# EAGLE design CMP3_Amp (EAGLE 9.2.1)
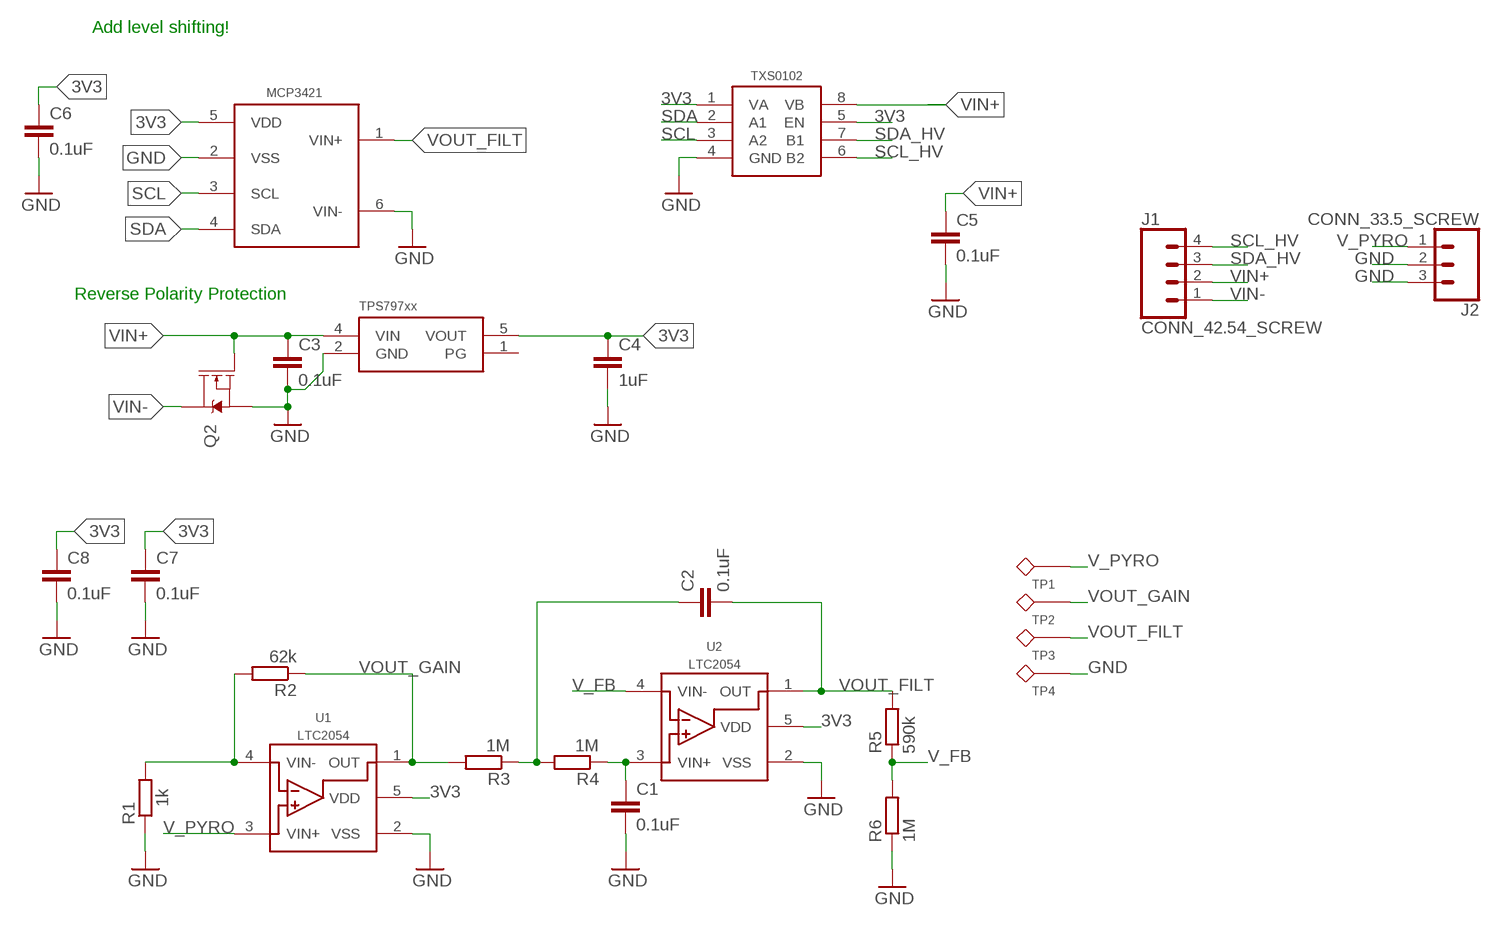
[diagram p0: schematic, sheet 1]

## Parts
C1  0.1uF  C-EU0.1UFC0603  [C0603]
C2  0.1uF  C-EU0.1UFC0603  [C0603]
C3  0.1uF  C-EU0.1UFC0603  [C0603]
C4  1uF  C-EU1UFC0603  [C0603]
C5  0.1uF  C-EU0.1UFC0402  [C0402]
C6  0.1uF  C-EU0.1UFC0402  [C0402]
C7  0.1uF  C-EU0.1UFC0402  [C0402]
C8  0.1uF  C-EU0.1UFC0402  [C0402]
J1  CONN_42.54_SCREW  [1X04_SCREW]
J2  CONN_33.5_SCREW  [1X03_3.5MM_SCREW]
Q2  DMG3404  MOSFET-NCH-DMG3404L  [SOT23-3]
R1  1k  R-EU_P1KR0603  [R0603]
R2  62k  R-EU_P62KR0603  [R0603]
R3  1M  R-EU_1MR0603  [R0603]
R4  1M  R-EU_1MR0603  [R0603]
R5  590k  R-EU_590KR0603  [R0603]
R6  1M  R-EU_1MR0603  [R0603]
TP1  TESTPOINTRCU  [TESTPOINT_0603]
TP2  TESTPOINTRCU  [TESTPOINT_0603]
TP3  TESTPOINTRCU  [TESTPOINT_0603]
TP4  TESTPOINTRCU  [TESTPOINT_0603]
U1  LTC2054  [SOT23-5]
U2  LTC2054  [SOT23-5]
U3  MCP3421A1  [SOT23-6L]
U4  TXS0102DQM  [DQM_R-PX2SON-N8]
U5  TPS79733  [DCK_R-PDSO-G5]

## Nets
3V3: C4.1 C6.1 C7.1 C8.1 U1.5(VDD) U2.5(VDD) U3.5(VDD) U4.1(VA) U4.5(EN) U5.5(VOUT)
GND: C1.2 C3.2 C4.2 C5.2 C6.2 C7.2 C8.2 J2.2 J2.3 Q2.2(S) R1.1 R6.1 TP4.1 U1.2(VSS) U2.2(VSS) U3.2(VSS) U3.6(VIN-) U4.4(GND) U5.2(GND)
N$2: R1.2 R2.2 U1.4(VIN-)
N$5: C2.1 R3.1 R4.2
N$6: C1.1 R4.1 U2.3(VIN+)
SCL: U3.3(SCL) U4.3(A2)
SCL_HV: J1.4 U4.6(B2)
SDA: U3.4(SDA) U4.2(A1)
SDA_HV: J1.3 U4.7(B1)
V_FB: R5.1 R6.2 U2.4(VIN-)
V_PYRO: J2.1 TP1.1 U1.3(VIN+)
VIN+: C3.1 C5.1 J1.2 Q2.1(G) U4.8(VB) U5.4(VIN)
VIN-: J1.1 Q2.3(D)
VOUT_FILT: C2.2 R5.2 TP3.1 U2.1(OUT) U3.1(VIN+)
VOUT_GAIN: R2.1 R3.2 TP2.1 U1.1(OUT)
Unconnected: U5.1(PG)

## Notes on the sheet
- Add level shifting!
- Reverse Polarity Protection

## Library data of the parts
C1-C3 = bschulz_passives:C-EU: CAPACITOR, European symbol; DIGIKEY: 490-6051-1-ND; MF: Murata; MPN: GCM188R71E104KA57D
C4 = bschulz_passives:C-EU: CAPACITOR, European symbol; DIGIKEY: 490-10479-1-ND; MF: Murata; MPN: GRM188R61C105KA12D
C5-C8 = bschulz_passives:C-EU: CAPACITOR, European symbol; DIGIKEY: 490-4759-1-ND; MF: Murata; MPN: GCM155R71C104KA55D
J1 = bschulz:CONN_4: Genaric 4 pin connector; DIGIKEY: ED10563-ND; MF: On Shore; MPN: OSTVN04A150
J2 = bschulz:CONN_3: Genaric 3 pin connector; DIGIKEY: ED2636-ND; MF: OnShore; MPN: OSTTE030161
Q2 = bschulz:MOSFET-NCH: N-channel MOSFETs Voltage controlled devices that allow control of high current outputs. SparkFun Products: SparkFun OpenScale <https://www.sparkfun.com/products/13261> SparkFun Digital Sandbox <https://www.sparkfun.com/products/12651> SparkFun Monster Moto Shield <https://www.sparkfun.com/products/10182> SparkFun MOSFET Power Controller <https://www.sparkfun.com/products/11214>; DIGIKEY: DMG3404L-7DICT-ND; MF: Diodes Incorporated; MPN: DMG3404L-7
R1 = bschulz_passives:R-EU_: RESISTOR, European symbol Digikey Parts: Yageo, 0402 <https://www.digikey.com/products/en/resistors/chip-resistor-surface-mount/52?k=&pkeyword=&sf=0&FV=ffec1104%2Cfffc000d%2C1c0002%2C440067%2C1f140000%2Cffe00034%2C400004&quantity=&ColumnSort=0&page=1&stock=1&pageSize=25> Yageo, 0603 <https://www.digikey.com/products/en/resistors/chip-resistor-surface-mount/52?k=&pkeyword=&s=4356&s=47360&sf=0&FV=fffc000d%2C1c0002%2C142c040c%2C1f140000%2Cffe00034&quantity=10&ColumnSort=1000011&page=1&stock=1&pageSize=25> Panasonic, 0603 <https://www.digikey.com/products/en/resistors/chip-resistor-surface-mount/52?k=&pkeyword=&pv252=68&sf=0&FV=ffec373d%2C1c0002%2C142c040c%2C1f140000%2Cffe00034%2C80002%2Cc0001&quantity=&ColumnSort=0&page=1&stock=1&pageSize=25> Panasonic, precision, 0603 <https://www.digikey.com/products/en/resistors/chip-resistor-surface-mount/52?FV=ffec4907%2Cfffc000a%2Cc0172%2C142c040c%2C1f140000%2Cffe00034%2C1c0002&quantity=100&ColumnSort=2085&page=1&stock=1&pageSize=25> Panasonic, 0805 <https://www.digikey.com/products/en/resistors/chip-resistor-surface-mount/52?k=&pkeyword=&pv3=1&sf=0&FV=ffec373d%2C1c0002%2C1f140000%2Cffe00034%2C142c040d&quantity=&ColumnSort=0&page=1&stock=1&pageSize=25> Rohm, current sense <https://www.digikey.com/products/en/resistors/chip-resistor-surface-mount/52?k=&pkeyword=&pv3=1&sf=0&FV=ffecb688%2C1f140000%2Cffe00034%2C1c0002&quantity=&ColumnSort=0&page=1&stock=1&pageSize=25> Vishay, pulse proof automotive <https://www.digikey.com/products/en/resistors/chip-resistor-surface-mount/52?k=&pkeyword=&pv7=2&sf=0&FV=ffec5d6b%2Cffe00034%2C1f140000&quantity=&ColumnSort=0&page=1&stock=1&pageSize=25>; DIGIKEY: P1.0KDBCT-ND; MF: Panasonic; MPN: ERA-3AEB102V; VALUE_PART: 1k
R2 = bschulz_passives:R-EU_: RESISTOR, European symbol Digikey Parts: Yageo, 0402 <https://www.digikey.com/products/en/resistors/chip-resistor-surface-mount/52?k=&pkeyword=&sf=0&FV=ffec1104%2Cfffc000d%2C1c0002%2C440067%2C1f140000%2Cffe00034%2C400004&quantity=&ColumnSort=0&page=1&stock=1&pageSize=25> Yageo, 0603 <https://www.digikey.com/products/en/resistors/chip-resistor-surface-mount/52?k=&pkeyword=&s=4356&s=47360&sf=0&FV=fffc000d%2C1c0002%2C142c040c%2C1f140000%2Cffe00034&quantity=10&ColumnSort=1000011&page=1&stock=1&pageSize=25> Panasonic, 0603 <https://www.digikey.com/products/en/resistors/chip-resistor-surface-mount/52?k=&pkeyword=&pv252=68&sf=0&FV=ffec373d%2C1c0002%2C142c040c%2C1f140000%2Cffe00034%2C80002%2Cc0001&quantity=&ColumnSort=0&page=1&stock=1&pageSize=25> Panasonic, precision, 0603 <https://www.digikey.com/products/en/resistors/chip-resistor-surface-mount/52?FV=ffec4907%2Cfffc000a%2Cc0172%2C142c040c%2C1f140000%2Cffe00034%2C1c0002&quantity=100&ColumnSort=2085&page=1&stock=1&pageSize=25> Panasonic, 0805 <https://www.digikey.com/products/en/resistors/chip-resistor-surface-mount/52?k=&pkeyword=&pv3=1&sf=0&FV=ffec373d%2C1c0002%2C1f140000%2Cffe00034%2C142c040d&quantity=&ColumnSort=0&page=1&stock=1&pageSize=25> Rohm, current sense <https://www.digikey.com/products/en/resistors/chip-resistor-surface-mount/52?k=&pkeyword=&pv3=1&sf=0&FV=ffecb688%2C1f140000%2Cffe00034%2C1c0002&quantity=&ColumnSort=0&page=1&stock=1&pageSize=25> Vishay, pulse proof automotive <https://www.digikey.com/products/en/resistors/chip-resistor-surface-mount/52?k=&pkeyword=&pv7=2&sf=0&FV=ffec5d6b%2Cffe00034%2C1f140000&quantity=&ColumnSort=0&page=1&stock=1&pageSize=25>; DIGIKEY: P62KDBCT-ND; MF: Panasonic; MPN: ERA-3AEB623V; VALUE_PART: 62k
R3 R4 R6 = bschulz_passives:R-EU_: RESISTOR, European symbol Digikey Parts: Yageo, 0402 <https://www.digikey.com/products/en/resistors/chip-resistor-surface-mount/52?k=&pkeyword=&sf=0&FV=ffec1104%2Cfffc000d%2C1c0002%2C440067%2C1f140000%2Cffe00034%2C400004&quantity=&ColumnSort=0&page=1&stock=1&pageSize=25> Yageo, 0603 <https://www.digikey.com/products/en/resistors/chip-resistor-surface-mount/52?k=&pkeyword=&s=4356&s=47360&sf=0&FV=fffc000d%2C1c0002%2C142c040c%2C1f140000%2Cffe00034&quantity=10&ColumnSort=1000011&page=1&stock=1&pageSize=25> Panasonic, 0603 <https://www.digikey.com/products/en/resistors/chip-resistor-surface-mount/52?k=&pkeyword=&pv252=68&sf=0&FV=ffec373d%2C1c0002%2C142c040c%2C1f140000%2Cffe00034%2C80002%2Cc0001&quantity=&ColumnSort=0&page=1&stock=1&pageSize=25> Panasonic, precision, 0603 <https://www.digikey.com/products/en/resistors/chip-resistor-surface-mount/52?FV=ffec4907%2Cfffc000a%2Cc0172%2C142c040c%2C1f140000%2Cffe00034%2C1c0002&quantity=100&ColumnSort=2085&page=1&stock=1&pageSize=25> Panasonic, 0805 <https://www.digikey.com/products/en/resistors/chip-resistor-surface-mount/52?k=&pkeyword=&pv3=1&sf=0&FV=ffec373d%2C1c0002%2C1f140000%2Cffe00034%2C142c040d&quantity=&ColumnSort=0&page=1&stock=1&pageSize=25> Rohm, current sense <https://www.digikey.com/products/en/resistors/chip-resistor-surface-mount/52?k=&pkeyword=&pv3=1&sf=0&FV=ffecb688%2C1f140000%2Cffe00034%2C1c0002&quantity=&ColumnSort=0&page=1&stock=1&pageSize=25> Vishay, pulse proof automotive <https://www.digikey.com/products/en/resistors/chip-resistor-surface-mount/52?k=&pkeyword=&pv7=2&sf=0&FV=ffec5d6b%2Cffe00034%2C1f140000&quantity=&ColumnSort=0&page=1&stock=1&pageSize=25>; DIGIKEY: P1.00MHCT-ND; MF: Panasonic; MPN: ERJ-3EKF1004V; VALUE_PART: 1M
R5 = bschulz_passives:R-EU_: RESISTOR, European symbol Digikey Parts: Yageo, 0402 <https://www.digikey.com/products/en/resistors/chip-resistor-surface-mount/52?k=&pkeyword=&sf=0&FV=ffec1104%2Cfffc000d%2C1c0002%2C440067%2C1f140000%2Cffe00034%2C400004&quantity=&ColumnSort=0&page=1&stock=1&pageSize=25> Yageo, 0603 <https://www.digikey.com/products/en/resistors/chip-resistor-surface-mount/52?k=&pkeyword=&s=4356&s=47360&sf=0&FV=fffc000d%2C1c0002%2C142c040c%2C1f140000%2Cffe00034&quantity=10&ColumnSort=1000011&page=1&stock=1&pageSize=25> Panasonic, 0603 <https://www.digikey.com/products/en/resistors/chip-resistor-surface-mount/52?k=&pkeyword=&pv252=68&sf=0&FV=ffec373d%2C1c0002%2C142c040c%2C1f140000%2Cffe00034%2C80002%2Cc0001&quantity=&ColumnSort=0&page=1&stock=1&pageSize=25> Panasonic, precision, 0603 <https://www.digikey.com/products/en/resistors/chip-resistor-surface-mount/52?FV=ffec4907%2Cfffc000a%2Cc0172%2C142c040c%2C1f140000%2Cffe00034%2C1c0002&quantity=100&ColumnSort=2085&page=1&stock=1&pageSize=25> Panasonic, 0805 <https://www.digikey.com/products/en/resistors/chip-resistor-surface-mount/52?k=&pkeyword=&pv3=1&sf=0&FV=ffec373d%2C1c0002%2C1f140000%2Cffe00034%2C142c040d&quantity=&ColumnSort=0&page=1&stock=1&pageSize=25> Rohm, current sense <https://www.digikey.com/products/en/resistors/chip-resistor-surface-mount/52?k=&pkeyword=&pv3=1&sf=0&FV=ffecb688%2C1f140000%2Cffe00034%2C1c0002&quantity=&ColumnSort=0&page=1&stock=1&pageSize=25> Vishay, pulse proof automotive <https://www.digikey.com/products/en/resistors/chip-resistor-surface-mount/52?k=&pkeyword=&pv7=2&sf=0&FV=ffec5d6b%2Cffe00034%2C1f140000&quantity=&ColumnSort=0&page=1&stock=1&pageSize=25>; DIGIKEY: 311-590KHRCT-ND; MF: Yageo; MPN: RC0603FR-07590KL; VALUE_PART: 590k
TP1-TP4 = bschulz:TESTPOINT; DIGIKEY: A106145CT-ND; MF: TE Connectivity; MPN: RCU-0C
U1 U2 = bschulz:LTC2054: LTC2054 -Single Micropower Zero Drift Op-Amp Characteristics: Vs: 2.7 ~ 6V (2.7 ~ +/- 5.5V for LTC2054HV) Iq: 175uA GBP: 500kHz PSSR: 130dB CMMR: 130dB Operating Temperature: -40°C to 85°C Digikey: LTC2054CS5#TRPBFCT-ND <https://www.digikey.com/scripts/DkSearch/dksus.dll?Detail&itemSeq=258611552&uq=636603257096973101> LTC2054HVIS5#TRMPBFCT-ND (High Voltage Variant) <https://www.digikey.com/product-detail/en/linear-technology-analog-devices/LTC2054HVIS5-TRMPBF/LTC2054HVIS5-TRMPBFCT-ND/3830416>; DIGIKEY: LTC2054HS5#TRMPBFCT-ND; DISP: LTC2054; MF: LT; MPN: LTC2054HS5#TRMPBF
U3 = bschulz:MCP342*: MCP342* - Sigma Delta ADC Characteristics: VCC: 2.7~5.5V Operating Temperature: -40°C to 125°C Number of Inputs: 1 (Differenital) Sample Rate: 15 Samples Per Second Number of Bits: 16 (MCP3425), 18 (MCP3421) Digikey: MCP3421 MCP3425A0T-E/CHCT-ND <https://www.digikey.com/product-detail/en/microchip-technology/MCP3425A0T-E-CH/MCP3425A0T-E-CHCT-ND/1979810> MCP3425 MCP3421A0T-E/CHCT-ND <https://www.digikey.com/product-detail/en/microchip-technology/MCP3421A0T-E-CH/MCP3421A0T-E-CHCT-ND/2183406> MCP3421A1T-E/CHCT-ND <https://www.digikey.com/product-detail/en/microchip-technology/MCP3421A1T-E-CH/MCP3421A1T-E-CHCT-ND/2183407> MCP3421A3T-E/CHCT-ND <https://www.digikey.com/product-detail/en/microchip-technology/MCP3421A3T-E-CH/MCP3421A3T-E-CHCT-ND/2183409>; DIGIKEY: MCP3421A1T-E/CHCT-ND; DISP: MCP3421; MF: Microchip; MPN: MCP3421A1T-E/CH
U4 = bschulz:TXS0102: TXS0102 - 2 Channel Bidirectional Voltage Level Translator Characteristics: Vcc: 1.65 ~ 3.6V (Port A), 2.3 ~ 5.5V (Port B) IQ: 14.4μA Output Current: 50mA Output Type: Open Drain/Push-Pull Operating Temperature: -40°C to 85°C Digikey: 296-28368-1-ND (DQE) <https://www.digikey.com/product-detail/en/texas-instruments/TXS0102DQER/296-28368-1-ND/2625893> 296-28435-1-ND (DQM) <https://www.digikey.com/product-detail/en/texas-instruments/TXS0102DQMR/296-28435-1-ND/2638910> 296-21931-1-ND (DCU) <https://www.digikey.com/product-detail/en/texas-instruments/TXS0102DCUR/296-21931-1-ND/1629284>; DIGIKEY: 296-28435-1-ND; MF: TI; MPN: TXS0102DQMR
U5 = bschulz:TPS797*: TPS797* - Ultra Low Power Low Dropout Linear Regulator Characteristics: Vin: 1.4V ~ 5.5V Vout: 1.8, 2.85, 3.0, 3.3V fixed IQ: 1.2μA typ, 2μA max Voltage Accuracy: 4% max Dropout Voltage: 105mV @ 10mA Output Current: 50 mA Operating Temperature: -40°C to 85°C Digikey: TPS79733 (3.3V Fixed) <https://www.digikey.com/product-detail/en/texas-instruments/TPS79733DCKR/296-11990-1-ND/390520> TPS79730 (3.0V Fixed) <https://www.digikey.com/product-detail/en/texas-instruments/TPS79730DCKR/296-11989-1-ND/390518> TPS797285 (2.85V Fixed) <https://www.digikey.com/product-detail/en/texas-instruments/TPS797285DCKR/296-25465-1-ND/2187585> TPS79718 (1.8V Fixed) <https://www.digikey.com/product-detail/en/texas-instruments/TPS79718DCKR/296-11988-1-ND/390516>; DIGIKEY: 296-11990-1-ND; MF: TI; MPN: TPS79733DCKR

## Board
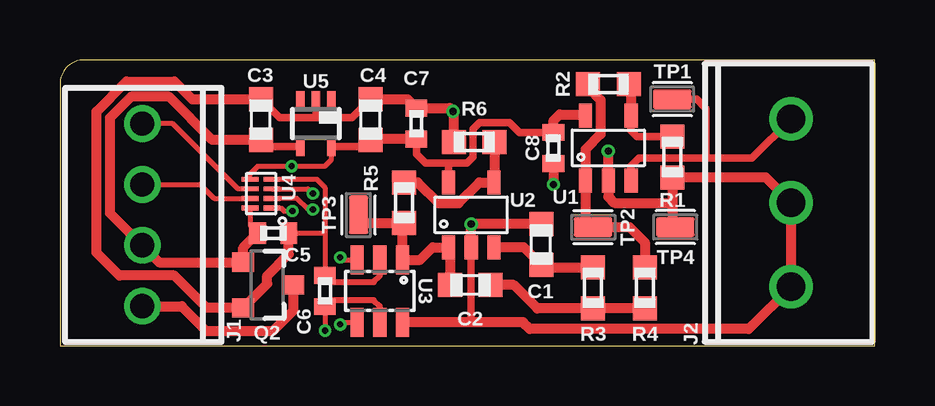
[diagram p1: board, top side]
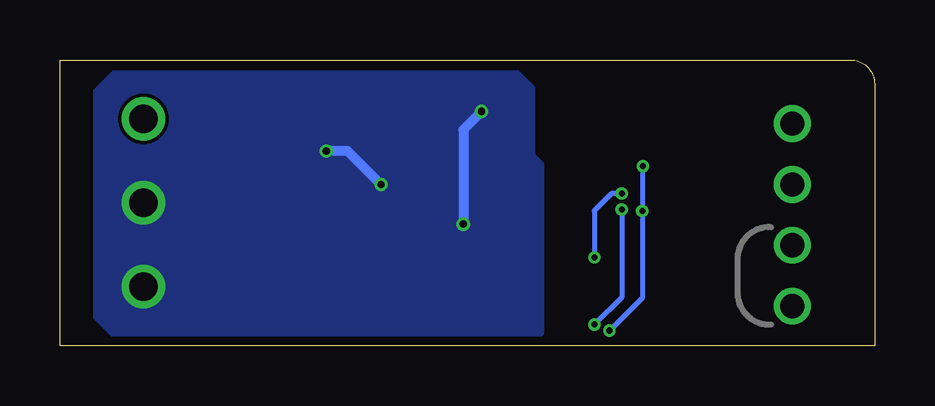
[diagram p2: board, bottom side, seen from below]

Size 33.96 x 11.93 mm. Coordinates in mm from the lower left corner, seen from the top.
Outline: 0,0 33.96,0 33.96,11.93 1,11.93 arc90 0,10.93 0,0
Copper layers (1*16): Top 0.035559375mm / dielectric 1.6mm / Bottom 0.035559375mm
Design rules "oshpark-2layer": minimum track width 6mil, minimum drill 10mil, track to track 6mil, track to pad 6mil, pad to pad 6mil, via to via 6mil, smd to smd 6mil, copper to edge 15mil, drill to drill 6mil, minimum pad ring 5mil, minimum via ring 5mil, stop-mask expansion 2.5mil, vias tented up to drill 0mil, thermal gap 10mil

### Footprints (pad centres in the part's own frame; a part is rotated, then mirrored left to right if it is on the bottom)
C0603 = smd 1 x 1: 1 -0.85,0; 2 0.85,0
C0402 = smd 0.7 x 0.9: 1 -0.65,0; 2 0.65,0
1X04_SCREW = drill 1.016: 1 -3.81,0; 2 -1.27,0; 3 1.27,0; 4 3.81,0
1X03_3.5MM_SCREW = drill 1.2: 1 -3.5,0; 2 0,0; 3 3.5,0
SOT23-3 = smd 0.8 x 0.9: 1 -0.95,-1; 2 0.95,-1; 3 0,1.1
R0603 = smd 1 x 1: 1 -0.85,0; 2 0.85,0
TESTPOINT_0603 = smd 1.6 x 0.8: 1 0,0
SOT23-5 = smd 0.55 x 1: 1 -0.95,-1.35; 2 0,-1.35; 3 0.95,-1.35; 4 0.95,1.35; 5 -0.95,1.35
SOT23-6L = smd 0.55 x 1.2: 1 -0.95,-1.3; 2 0,-1.3; 3 0.95,-1.3; 4 0.95,1.3; 5 0,1.3; 6 -0.95,1.3
DQM_R-PX2SON-N8 = smd 0.2 x 0.7: 1 -0.6,-0.45; 2 -0.2,-0.45; 3 0.2,-0.45; 4 0.6,-0.45; 5 0.6,0.45; 6 0.2,0.45; 7 -0.2,0.45; 8 -0.6,0.45
DCK_R-PDSO-G5 = smd 0.35 x 0.8: 1 -0.65,-0.95; 2 0,-0.95; 3 0.65,-0.95; 4 0.65,0.95; 5 -0.65,0.95

### Placement (x,y rotation side)
C1  20.07,4.23 90 top
C2  17.11,2.54 180 top
C3  8.38,9.44 90 top
C4  12.95,9.44 90 top
C5  8.89,4.7 0 top
C6  11.05,2.29 90 top
C7  14.86,9.27 90 top
C8  20.57,8.26 270 top
J1  3.43,5.46 90 top
J2  30.48,5.97 270 top
Q2  8.64,2.54 270 top
R1  25.53,7.87 90 top
R2  22.86,10.92 0 top
R3  24.38,2.41 90 top
R4  22.23,2.41 270 top
R5  14.35,5.97 270 top
R6  17.27,8.51 0 top
TP1  25.53,10.29 180 top
TP2  22.23,4.95 0 top
TP3  12.45,5.46 90 top
TP4  25.65,4.95 180 top
U1  22.86,8.26 0 top
U2  17.14,5.46 0 top
U3  13.34,2.29 180 top
U4  8.38,6.35 90 top
U5  10.67,9.27 180 top

### Tracks (layer width: path | path; a pad name or v marks a point on that pad's centre or on a via)
3V3  (via drill 0.25)
  Top 0.2: U4.5 7.93,7.17 8.26,7.49 v9.65,7.49 11.05,7.49 11.32,7.76 U5.5 | U4.1 9.21,5.75 9.34,5.62 v9.69,5.62 | C6.1 v11.05,0.64
  Top 0.254: U3.5 13.34,1.65 13.08,1.91 11.32,1.91 C6.1
  Top 0.305: U5.5 12.69,8.32 C4.1 | C8.1 19.16,8.9 18.75,9.31 17.5,9.31 17.23,9.04 17.23,7.88 16.96,7.62 16.26,7.62 | 16.26,7.62 15.24,7.62 14.86,8 C7.1 | U2.5 16.2,7.56 16.26,7.62
  Top 0.406: C8.1 20.57,9.4 20.83,9.65 21.86,9.65 U1.5 | C7.1 12.99,8.62 C4.1
  Bottom 0.2: v9.65,7.49 9.69,7.46 v9.69,5.62 9.69,2 v11.05,0.64
GND  (via drill 0.3)
  Top 0.2: U4.4 10.7,6.95 11.05,6.6 11.05,4.7 | 11.05,4.7 C6.2 | C5.2 11.05,4.7
  Top 0.254: C6.2 11.32,2.67 13.08,2.67 13.34,2.92 U3.2
  Top 0.305: U2.2 17.14,0.99 | C3.2 9.15,9.52 10.67,9.52 | C4.2 12.18,9.52 10.67,9.52 | U5.2 10.67,9.52
  Top 0.406: U1.2 22.86,7.02 | U3.6 17.14,0.99 19.31,0.99 19.59,0.71 28.72,0.71 J2.3 J2.2 29.43,7.02 R1.1 25.53,5.97 | U1.2 22.86,6.22 23.11,5.97 25.53,5.97 | U1.2 v22.86,8.13 | C8.2 v20.57,6.73 | U2.2 v17.14,5.08 C1.2 | R6.1 16.42,9.74 v16.38,9.78 16.24,9.92 C7.2 14.49,10.29 C4.2 | C5.2 9.54,3.83 8.64,2.92 8.64,2.59 Q2.2 6.11,1.59 4.77,2.93 2.47,2.93 1.52,3.88 1.52,9.78 2.77,11.02 4.78,11.02 5.52,10.29 C3.2 | 25.53,5.97 25.53,5.08 TP4.1
  Bottom 0.406: v16.38,9.78 17.14,9.02 v17.14,5.08 | v20.57,6.73 21.97,8.13 v22.86,8.13
  pour Bottom (no thermals): 14.86,11.43 14.22,10.79 14.22,8 13.84,7.62 13.84,0.51 14.1,0.25 31.62,0.25 32.51,1.14 32.51,10.67 31.75,11.43
N$2
  Top 0.305: R1.2 24.06,8.72 23.81,8.97 U1.4
  Top 0.406: R2.2 23.81,10.82 U1.4
N$5
  Top 0.406: R3.1 R4.2 19.9,1.56 18.92,2.54 C2.1
N$6
  Top 0.406: U2.3 19.34,4.11 C1.1 20.18,3.26 R4.1
SCL  (via drill 0.25)
  Top 0.2: U4.3 10.34,6.55 v10.54,6.35 | v11.68,3.68 11.78,3.59 U3.3
  Bottom 0.2: v10.54,6.35 10.98,6.35 11.68,5.64 v11.68,3.68
SCL_HV
  Top 0.2: U4.6 7.42,6.55 4.7,9.27 J1.4
SDA  (via drill 0.25)
  Top 0.2: v10.54,5.69 10.33,5.69 9.87,6.15 U4.2 | v11.68,0.89 11.78,0.99 U3.4
  Bottom 0.2: v10.54,5.69 10.54,2.03 v11.68,0.89
SDA_HV
  Top 0.2: J1.3 5.84,6.73 6.42,6.15 U4.7
V_FB
  Top 0.406: R5.1 14.91,6.82 15.77,5.96 16.62,5.96 17.48,6.82 U2.4 18.12,6.84 R6.2
V_PYRO
  Top 0.305: U1.3 23.81,7.5 24.14,7.83 26.92,7.83 | 26.92,7.83 28.84,7.83 J2.1 | 26.92,7.83 26.92,9.91 26.54,10.29 TP1.1
VIN+
  Top 0.2: U4.8 7.93,5.01 C5.1
  Top 0.305: C3.1 8.65,8.32 U5.4
  Top 0.406: C5.1 7.64,4.09 Q2.1 4.13,3.49 J1.2 2.08,5.54 2.08,9.51 2.97,10.39 4.55,10.39 6.35,8.59 C3.1
VIN-
  Top 0.406: J1.1 5.08,1.65 6.1,0.64 8.89,0.64 9.74,1.48 Q2.3
VOUT_FILT
  Top 0.406: TP3.1 12.79,5.12 R5.2 14.29,5.05 U3.1 15.02,3.59 15.54,4.11 U2.1 16.26,4.05 C2.2
VOUT_GAIN
  Top 0.406: R2.1 22.01,10.78 22.54,10.25 22.54,8.82 21.91,8.19 U1.1 21.91,5.27 TP2.1 23.75,4.95 24.38,4.32 R3.2

### Text on the board
tDocu: SCL | SDA | Vin+ | Vin-
bDocu: To Logger | To Sensor | CMP3 Amp v0.0 / -------------- / Designed by / Northern Widget and / University of Minnesota | (Red) | Vin | SCL | SDA | (Blue) | GND | 3.3v ~ 5v | Vin+ | ± | GND | Vin- | (Blk) | (CMP3)